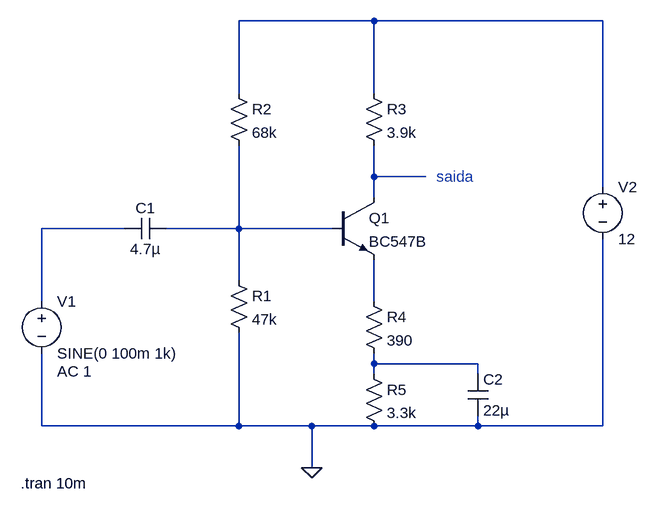
[diagram p0: schematic circuito amplificador.asc]
circuito amplificador.asc, the LTspice schematic file:
Version 4
SHEET 1 904 680
WIRE 496 -272 288 -272
WIRE 848 -272 496 -272
WIRE 288 -160 288 -272
WIRE 496 -160 496 -272
WIRE 496 -32 496 -80
WIRE 576 -32 496 -32
WIRE 848 -16 848 -272
WIRE 496 0 496 -32
WIRE 112 48 -16 48
WIRE 288 48 288 -80
WIRE 288 48 176 48
WIRE 432 48 288 48
WIRE 288 128 288 48
WIRE -16 160 -16 48
WIRE 496 160 496 96
WIRE 496 256 496 240
WIRE 656 256 496 256
WIRE 496 272 496 256
WIRE 656 272 656 256
WIRE -16 352 -16 240
WIRE 288 352 288 208
WIRE 288 352 -16 352
WIRE 400 352 288 352
WIRE 496 352 400 352
WIRE 656 352 656 336
WIRE 656 352 496 352
WIRE 848 352 848 64
WIRE 848 352 656 352
WIRE 400 416 400 352
FLAG 400 416 0
SYMBOL voltage -16 144 R0
WINDOW 123 24 124 Left 2
WINDOW 39 0 0 Left 0
SYMATTR InstName V1
SYMATTR Value SINE(0 100m 1k)
SYMATTR Value2 AC 1
SYMBOL cap 176 32 R90
WINDOW 0 0 32 VBottom 2
WINDOW 3 32 32 VTop 2
SYMATTR InstName C1
SYMATTR Value 4.7µ
SYMBOL res 272 112 R0
SYMATTR InstName R1
SYMATTR Value 47k
SYMBOL res 272 -176 R0
SYMATTR InstName R2
SYMATTR Value 68k
SYMBOL res 480 -176 R0
SYMATTR InstName R3
SYMATTR Value 3.9k
SYMBOL npn 432 0 R0
SYMATTR InstName Q1
SYMATTR Value BC547B
SYMBOL res 480 144 R0
SYMATTR InstName R4
SYMATTR Value 390
SYMBOL res 480 256 R0
SYMATTR InstName R5
SYMATTR Value 3.3k
SYMBOL cap 640 272 R0
SYMATTR InstName C2
SYMATTR Value 22µ
SYMBOL voltage 848 -32 R0
SYMATTR InstName V2
SYMATTR Value 12
TEXT -48 440 Left 2 !.tran 10m
TEXT 592 -32 Left 2 ;saida

The netlist it stands for:
* circuito amplificador.asc
V1 N003 0 SINE(0 100m 1k) AC 1
C1 N004 N003 4.7µ
R1 N004 0 47k
R2 N001 N004 68k
R3 N001 N002 3.9k
Q1 N002 N004 N005 0 BC547B
R4 N005 N006 390
R5 N006 0 3.3k
C2 N006 0 22µ
V2 N001 0 12
.model NPN NPN
.model PNP PNP
.lib standard.bjt
.tran 10m
* saida
.backanno
.end